# EAGLE design matrix5x5 (EAGLE 6.4)
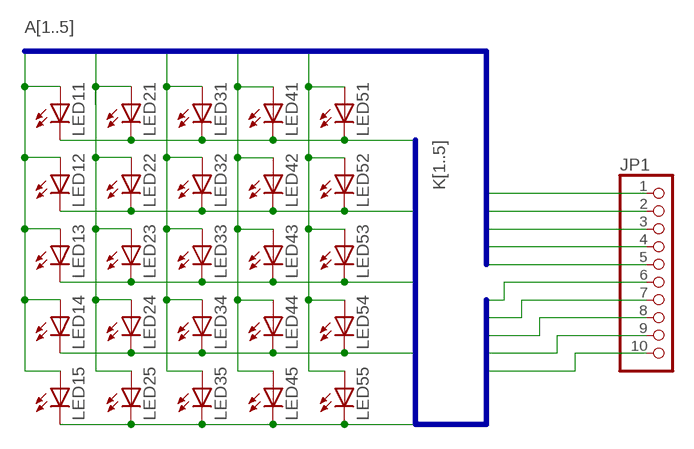
[diagram p0: schematic, sheet 1]

## Parts
JP1  PINHD-1X10  [1X10]
LED11  LED5MM  [LED5MM]
LED12  LED5MM  [LED5MM]
LED13  LED5MM  [LED5MM]
LED14  LED5MM  [LED5MM]
LED15  LED5MM  [LED5MM]
LED21  LED5MM  [LED5MM]
LED22  LED5MM  [LED5MM]
LED23  LED5MM  [LED5MM]
LED24  LED5MM  [LED5MM]
LED25  LED5MM  [LED5MM]
LED31  LED5MM  [LED5MM]
LED32  LED5MM  [LED5MM]
LED33  LED5MM  [LED5MM]
LED34  LED5MM  [LED5MM]
LED35  LED5MM  [LED5MM]
LED41  LED5MM  [LED5MM]
LED42  LED5MM  [LED5MM]
LED43  LED5MM  [LED5MM]
LED44  LED5MM  [LED5MM]
LED45  LED5MM  [LED5MM]
LED51  LED5MM  [LED5MM]
LED52  LED5MM  [LED5MM]
LED53  LED5MM  [LED5MM]
LED54  LED5MM  [LED5MM]
LED55  LED5MM  [LED5MM]

## Nets
A1: JP1.1 LED11.A LED12.A LED13.A LED14.A LED15.A
A2: JP1.2 LED21.A LED22.A LED23.A LED24.A LED25.A
A3: JP1.3 LED31.A LED32.A LED33.A LED34.A LED35.A
A4: JP1.4 LED41.A LED42.A LED43.A LED44.A LED45.A
A5: JP1.5 LED51.A LED52.A LED53.A LED54.A LED55.A
K1: JP1.6 LED11.K(C) LED21.K(C) LED31.K(C) LED41.K(C) LED51.K(C)
K2: JP1.7 LED12.K(C) LED22.K(C) LED32.K(C) LED42.K(C) LED52.K(C)
K3: JP1.8 LED13.K(C) LED23.K(C) LED33.K(C) LED43.K(C) LED53.K(C)
K4: JP1.9 LED14.K(C) LED24.K(C) LED34.K(C) LED44.K(C) LED54.K(C)
K5: JP1.10 LED15.K(C) LED25.K(C) LED35.K(C) LED45.K(C) LED55.K(C)

## Buses
K[1..5]
A[1..5]

## Library data of the parts
JP1 = pinhead:PINHD-1X10: PIN HEADER
LED11-LED15 LED21-LED25 LED31-LED35 LED41-LED45 LED51-LED55 = led:LED: LED OSRAM: - CHIPLED LG R971, LG N971, LY N971, LG Q971, LY Q971, LO R971, LY R971 LH N974, LH R974 LS Q976, LO Q976, LY Q976 LO Q996 - Hyper CHIPLED LW Q18S LB Q993, LB Q99A, LB R99A - SideLED LS A670, LO A670, LY A670, LG A670, LP A670 LB A673, LV A673, LT A673, LW A673 LH A674 LY A675 LS A676, LA A676, LO A676, LY A676, LW A676 LS A679, LY A679, LG A679 - Hyper Micro SIDELED® LS Y876, LA Y876, LO Y876, LY Y876 LT Y87S - SmartLED LW L88C, LW L88S LB L89C, LB L89S, LG L890 LS L89K, LO L89K, LY L89K LS L896, LA L896, LO L896, LY L896 - TOPLED LS T670, LO T670, LY T670, LG T670, LP T670 LSG T670, LSP T670, LSY T670, LOP T670, LYG T670 LG T671, LOG T671, LSG T671 LB T673, LV T673, LT T673, LW T673 LH T674 LS T676, LA T676, LO T676, LY T676, LB T676, LH T676, LSB T676, LW T676 LB T67C, LV T67C, LT T67C, LS T67K, LO T67K, LY T67K, LW E67C LS E67B, LA E67B, LO E67B, LY E67B, LB E67C, LV E67C, LT E67C LW T67C LS T679, LY T679, LG T679 LS T770, LO T770, LY T770, LG T770, LP T770 LB T773, LV T773, LT T773, LW T773 LH T774 LS E675, LA E675, LY E675, LS T675 LS T776, LA T776, LO T776, LY T776, LB T776 LHGB T686 LT T68C, LB T68C - Hyper Mini TOPLED® LB M676 - Mini TOPLED Santana® LG M470 LS M47K, LO M47K, LY M47K Source: http://www.osram.convergy.de LUXEON: - LUMILED® LXK2-PW12-R00, LXK2-PW12-S00, LXK2-PW14-U00, LXK2-PW14-V00 LXK2-PM12-R00, LXK2-PM12-S00, LXK2-PM14-U00 LXK2-PE12-Q00, LXK2-PE12-R00, LXK2-PE12-S00, LXK2-PE14-T00, LXK2-PE14-U00 LXK2-PB12-K00, LXK2-PB12-L00, LXK2-PB12-M00, LXK2-PB14-N00, LXK2-PB14-P00, LXK2-PB14-Q00 LXK2-PR12-L00, LXK2-PR12-M00, LXK2-PR14-Q00, LXK2-PR14-R00 LXK2-PD12-Q00, LXK2-PD12-R00, LXK2-PD12-S00 LXK2-PH12-R00, LXK2-PH12-S00 LXK2-PL12-P00, LXK2-PL12-Q00, LXK2-PL12-R00 Source: www.luxeon.com KINGBRIGHT: KA-3528ASYC Source: www.kingbright.com

## Board
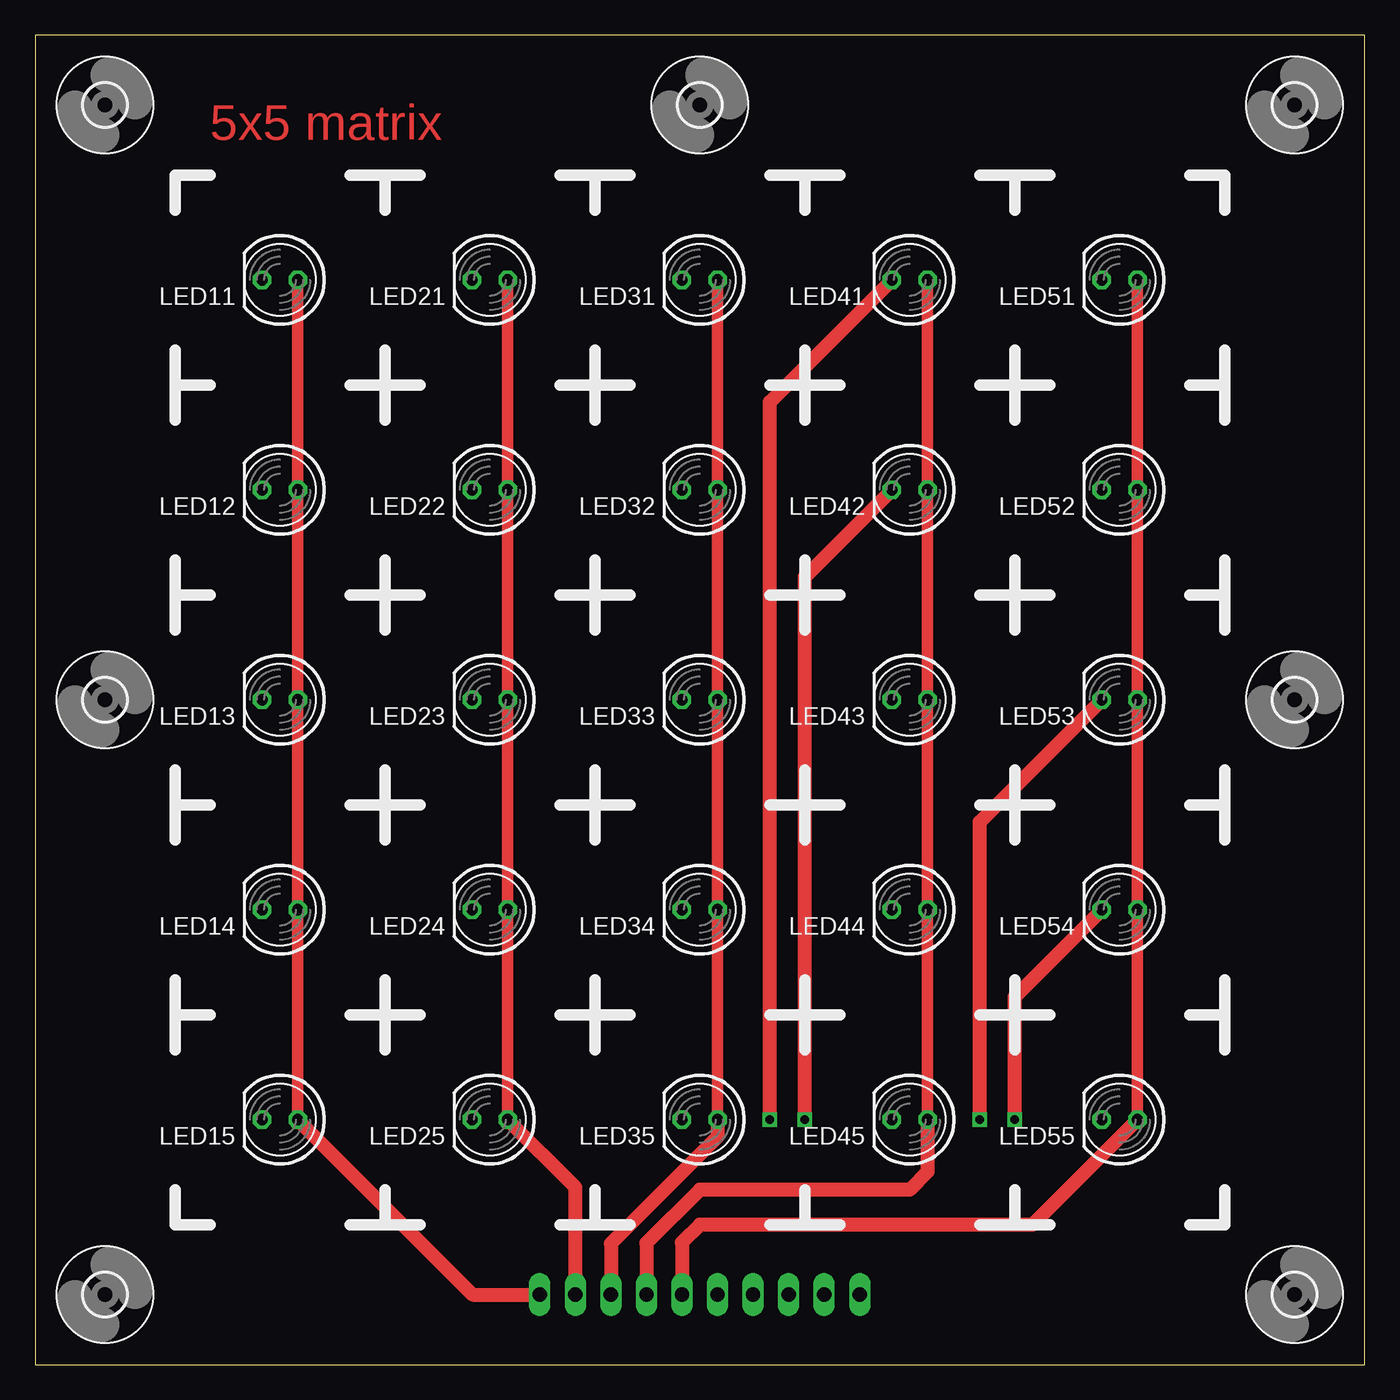
[diagram p1: board, top side]
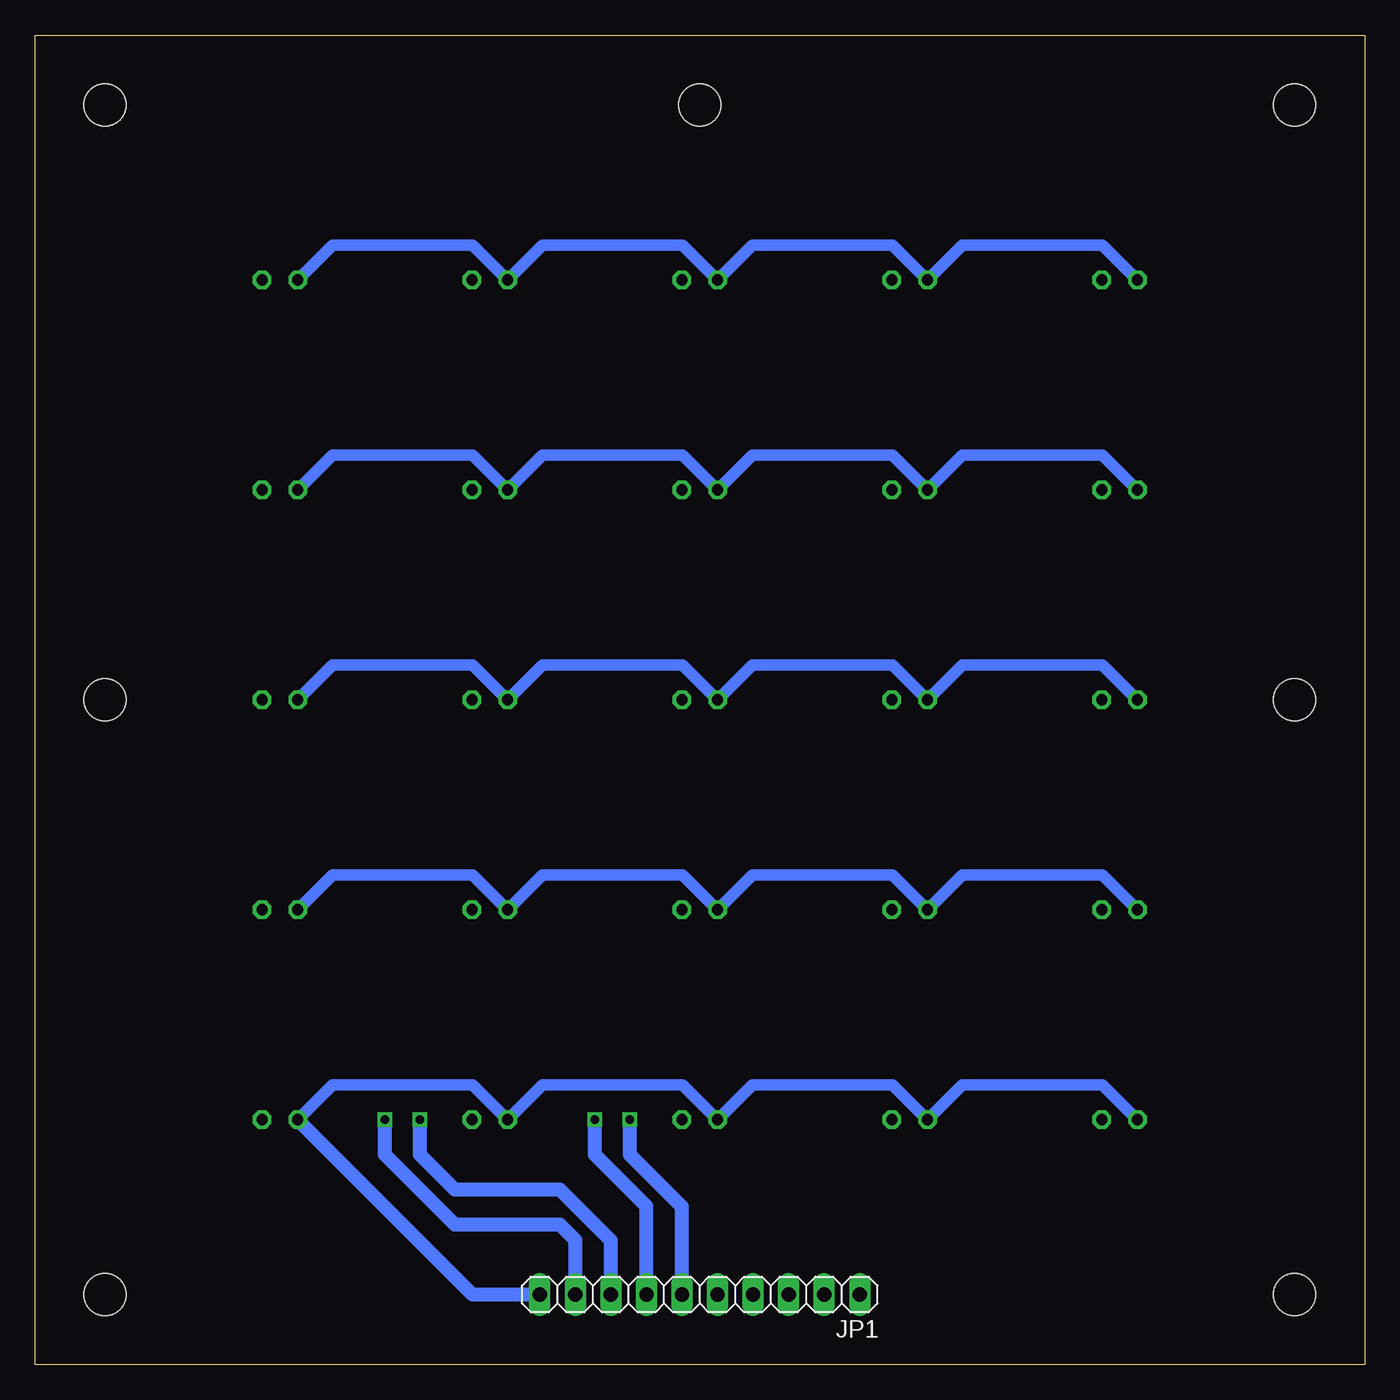
[diagram p2: board, bottom side, seen from below]

Size 95 x 95 mm. Coordinates in mm from the lower left corner, seen from the top.
Outline: 0,0 95,0 95,95 0,95 0,0
Copper layers (1*16): Top 0.035mm / dielectric 1.5mm / Bottom 0.035mm
Design rules "default": minimum track width 10mil, minimum drill 24mil, track to track 8mil, track to pad 8mil, pad to pad 8mil, via to via 8mil, smd to smd 8mil, copper to edge 40mil, drill to drill 8mil, minimum pad ring 10mil, minimum via ring 8mil, stop-mask expansion 4mil, vias tented up to drill 0mil, thermal gap 10mil

### Footprints (pad centres in the part's own frame; a part is rotated, then mirrored left to right if it is on the bottom)
1X10 = drill 1.016 long: 1 -11.43,0; 2 -8.89,0; 3 -6.35,0; 4 -3.81,0; 5 -1.27,0; 6 1.27,0; 7 3.81,0; 8 6.35,0; 9 8.89,0; 10 11.43,0
LED5MM = drill 0.813 octagon: A -1.27,0; K 1.27,0
3,0 = hole 3: 0,0

### Placement (x,y rotation side)
JP1  47.5,5 180 bottom
LED11  17.5,77.5 180 top
LED12  17.5,62.5 180 top
LED13  17.5,47.5 180 top
LED14  17.5,32.5 180 top
LED15  17.5,17.5 180 top
LED21  32.5,77.5 180 top
LED22  32.5,62.5 180 top
LED23  32.5,47.5 180 top
LED24  32.5,32.5 180 top
LED25  32.5,17.5 180 top
LED31  47.5,77.5 180 top
LED32  47.5,62.5 180 top
LED33  47.5,47.5 180 top
LED34  47.5,32.5 180 top
LED35  47.5,17.5 180 top
LED41  62.5,77.5 180 top
LED42  62.5,62.5 180 top
LED43  62.5,47.5 180 top
LED44  62.5,32.5 180 top
LED45  62.5,17.5 180 top
LED51  77.5,77.5 180 top
LED52  77.5,62.5 180 top
LED53  77.5,47.5 180 top
LED54  77.5,32.5 180 top
LED55  77.5,17.5 180 top
U$1  [3,0]  90,90 0 top
U$2  [3,0]  5,90 0 top
U$3  [3,0]  5,5 0 top
U$4  [3,0]  90,5 0 top
U$5  [3,0]  47.5,90 0 top
U$6  [3,0]  5,47.5 0 top
U$7  [3,0]  90,47.5 0 top

### Tracks (layer width: path | path; a pad name or v marks a point on that pad's centre or on a via)
A1
  Top 0.813: LED11.A LED12.A LED13.A LED14.A LED15.A
  Top 1.016: LED15.A 31.27,5 JP1.1
A2
  Top 0.813: LED25.A LED24.A LED23.A LED22.A LED21.A
  Top 1.016: JP1.2 38.61,12.66 LED25.A
A3
  Top 0.813: LED31.A LED32.A LED33.A LED34.A LED35.A
  Top 1.016: LED35.A 48.77,16.27 41.15,8.65 JP1.3
A4
  Top 0.813: LED41.A LED42.A LED43.A LED44.A LED45.A
  Top 1.016: JP1.4 43.69,8.69 47.5,12.5 62.5,12.5 63.77,13.77 LED45.A
A5
  Top 0.813: LED51.A LED52.A LED53.A LED54.A LED55.A
  Top 1.016: LED55.A 71.27,10 47.5,10 46.23,8.73 JP1.5
K1  (via drill 0.6)
  Top 1.016: v52.5,17.5 52.5,68.77 LED41.K
  Bottom 0.813: LED51.K 73.73,80 63.73,80 LED41.K 58.73,80 48.73,80 LED31.K 43.73,80 33.73,80 LED21.K 28.73,80 18.73,80 LED11.K
  Bottom 1.016: JP1.6 48.77,11.27 52.5,15 v52.5,17.5
K2  (via drill 0.6)
  Top 1.016: v55,17.5 55,56.27 LED42.K
  Bottom 0.813: LED12.K 18.73,65 28.73,65 LED22.K 33.73,65 43.73,65 LED32.K 48.73,65 58.73,65 LED42.K 63.73,65 73.73,65 LED52.K
  Bottom 1.016: JP1.7 51.31,11.31 55,15 v55,17.5
K3  (via drill 0.6)
  Top 1.016: v67.5,17.5 67.5,38.77 LED53.K
  Bottom 0.813: LED13.K 18.73,50 28.73,50 LED23.K 33.73,50 43.73,50 LED33.K 48.73,50 58.73,50 LED43.K 63.73,50 73.73,50 LED53.K
  Bottom 1.016: JP1.8 53.85,8.85 57.5,12.5 65,12.5 67.5,15 v67.5,17.5
K4  (via drill 0.6)
  Top 1.016: v70,17.5 70,26.27 LED54.K
  Bottom 0.813: LED14.K 18.73,35 28.73,35 LED24.K 33.73,35 43.73,35 LED34.K 48.73,35 58.73,35 LED44.K 63.73,35 73.73,35 LED54.K
  Bottom 1.016: JP1.9 56.39,8.89 57.5,10 65,10 70,15 v70,17.5
K5
  Bottom 0.813: LED15.K 18.73,20 28.73,20 LED25.K 33.73,20 43.73,20 LED35.K 48.73,20 58.73,20 LED45.K 63.73,20 73.73,20 LED55.K
  Bottom 1.016: JP1.10 63.73,5 LED55.K

### Text on the board
Top: 5x5 matrix